# Altium project power_board.PrjPcb
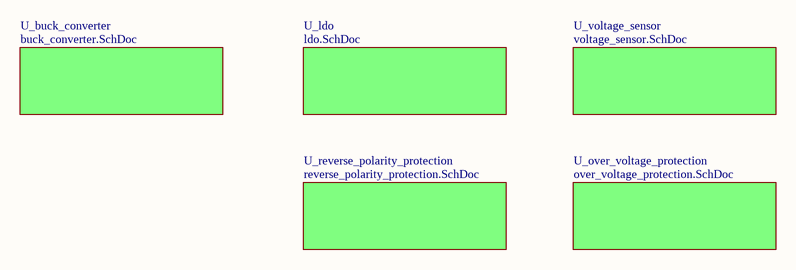
[diagram p0: top_level.SchDoc]
6 sheets, 18 parts. Net scope: hierarchical (ports join the sheet entries above them; power ports are global).
Board file: power_board_v0.PcbDoc
Sheets:
  top_level.SchDoc
    U_buck_converter = buck_converter.SchDoc
    U_voltage_sensor = voltage_sensor.SchDoc
    U_over_voltage_protection = over_voltage_protection.SchDoc
    U_reverse_polarity_protection = reverse_polarity_protection.SchDoc
  ldo_3v3.SchDoc

## Sheet top_level.SchDoc
size A3; SheetNumber: 1; SheetTotal: 6

### Sub-sheets
U_buck_converter = buck_converter.SchDoc: no entries
U_ldo = ldo.SchDoc (file not in this document): no entries
U_over_voltage_protection = over_voltage_protection.SchDoc: no entries
U_reverse_polarity_protection = reverse_polarity_protection.SchDoc: no entries
U_voltage_sensor = voltage_sensor.SchDoc: no entries

## Sheet buck_converter.SchDoc
size A3; SheetNumber: 2; SheetTotal: 2

## Sheet voltage_sensor.SchDoc
size A3; SheetNumber: 4; SheetTotal: 6

## Sheet over_voltage_protection.SchDoc
size A3; SheetNumber: 6; SheetTotal: 6

## Sheet reverse_polarity_protection.SchDoc
size A4; SheetNumber: 2; SheetTotal: 4
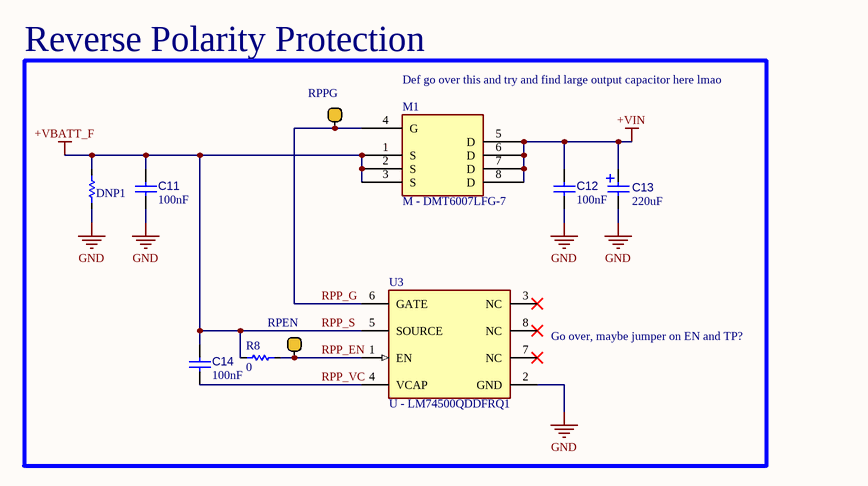
[diagram p1: reverse_polarity_protection.SchDoc]

### Parts
C11  value 100nF  [CAP_0603]  (hidden comment: C - CAP CER 100nF 100V 10% 0603)
C12  value 100nF  [CAP_0603]  (hidden comment: C - CAP CER 100nF 100V 10% 0603)
C13  value 220uF  [C - 860020574012]  (hidden comment: 860020574012)
C14  value 100nF  [CAP_0603]  (hidden comment: C - CAP CER 100nF 100V 10% 0603)
DNP1  DNP - DNP PAD 0603  [DNP 0603]  (value not drawn)
M1  M - DMT6007LFG-7  [M - DMT6007LFG-7]
R8  value 0  [RES 0603]  (hidden comment: R - RES 0R 0.1W N/A% 0603)
RPEN  TP - SMD Pad Testpoint-Symbol-1  [TP - SMD Pad Testpoint]  (value not drawn)
RPPG  TP - SMD Pad Testpoint-Symbol-1  [TP - SMD Pad Testpoint]  (value not drawn)
U3  U - LM74500QDDFRQ1  [U - LM74500QDDFRQ1]

### Nets
+VBATT_F: C11.2 C14.2 DNP1.2 M1.1(S) M1.2(S) M1.3(S) R8.1 U3.5(SOURCE)  [also labelled RPP_S]
+VIN: C12.2 C13.1(POS) M1.5(D) M1.6(D) M1.7(D) M1.8(D)
GND: C11.1 C12.1 C13.2(NEG) DNP1.1 U3.2(GND)
RPP_EN: R8.2 RPEN.1 U3.1(EN)
RPP_G: M1.4(G) RPPG.1 U3.6(GATE)
RPP_VC: C14.1 U3.4(VCAP)

Not connected (* = marked no-connect by the designer): U3 3(NC)* 7(NC)* 8(NC)*

### Notes on the sheet
- Reverse Polarity Protection
- (near M1) Def go over this and try and find large output capacitor here lmao
- (near U3) Go over, maybe jumper on EN and TP?

### Library data of the parts
C11 C12 C14 = C - CAP CER 100nF 100V 10% 0603: GRM188R72A104KA35D - 0.1 µF ±10% 100V Ceramic Capacitor X7R 0603 (1608 Metric); Parameter 2: *
C13 = C - CAP ELC 220uF 35V 20% CAN: 860020574012 - 220 µF 35 V Aluminum Electrolytic Capacitors Radial, Can 2000 Hrs @ 105°C; Parameter 2: *
M1 = M - DMT6007LFG-7: DMT6007LFG-7 - N-Channel 60 V 15A (Ta), 80A (Tc) 2.2W (Ta), 62.5W (Tc) Surface Mount POWERDI3333-8
R8 = R - RES 0R 0.1W N/A% 0603: ERJ-3GEY0R00V - 0 Ohms Jumper Chip Resistor 0603 (1608 Metric) Automotive AEC-Q200 Thick Film
RPEN RPPG = TP - SMD Pad Testpoint-Symbol-1: Testpoint used for debugging and testing. SMD Pad
U3 = U - LM74500QDDFRQ1: LM74500QDDFRQ1 - Battery Battery Protection IC TSOT-23-8

## Sheet ldo_3v3.SchDoc
size A; SheetNumber: 4; SheetTotal: 4
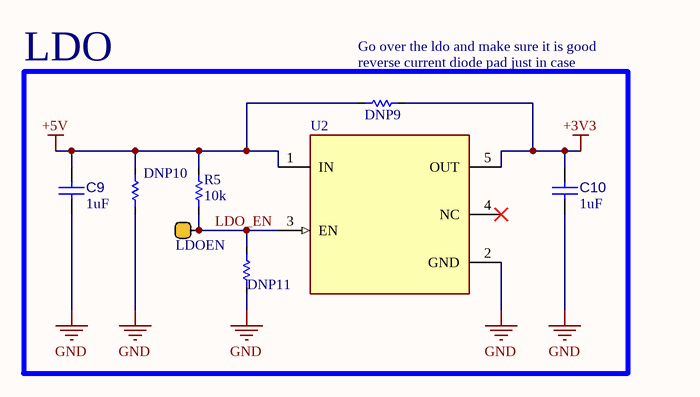
[diagram p2: ldo_3v3.SchDoc]

### Parts
C9  value 1uF  [CAP_0603]  (hidden comment: CAP CER 220nF 50V 10% 0603)
C10  value 1uF  [CAP_0603]  (hidden comment: CAP CER 220nF 50V 10% 0603)
DNP9  DNP - DNP PAD 0603  [DNP 0603]  (value not drawn)
DNP10  DNP - DNP PAD 0603  [DNP 0603]  (value not drawn)
DNP11  DNP - DNP PAD 0603  [DNP 0603]  (value not drawn)
LDOEN  TP - SMD Pad Testpoint-Symbol-1  [TP - SMD Pad Testpoint]  (value not drawn)
R5  value 10k  [RES 0603]  (hidden comment: R - RES 10kR 0.1W 1% 0603)
U2  TLV75733PDBVR  [U - TLV75733PDBVR]  (value not drawn)

### Nets
+3V3: C10.2 DNP9.2 U2.5(OUT)
+5V: C9.2 DNP9.1 DNP10.2 R5.2 U2.1(IN)
GND: C9.1 C10.1 DNP10.1 DNP11.1 U2.2(GND)
LDO_EN: DNP11.2 LDOEN.1 R5.1 U2.3(EN)

Not connected (* = marked no-connect by the designer): U2 4(NC)*

### Notes on the sheet
- (near DNP9) Go over the ldo and make sure it is good
- LDO
- (near DNP9) reverse current diode pad just in case

### Library data of the parts
C9 C10 = C - CAP CER 1uF 25V 10% 0603: GCJ188R71E105KA01D - 1 µF ±10% 25V Ceramic Capacitor X7R 0603 (1608 Metric); Parameter 2: *
LDOEN = TP - SMD Pad Testpoint-Symbol-1: as RPEN on sheet reverse_polarity_protection
R5 = R - RES 10kR 0.1W 1% 0603: ERA-3AEB103V - 10 kOhms ±0.1% 0.1W, 1/10W Chip Resistor 0603 (1608 Metric) Automotive AEC-Q200 Thin Film
U2 = U - TLV75733PDBVR: TLV75733PDBVR - 1-A, low-IQ high-accuracy low-dropout (LDO) voltage regulator with enable 5-SOT-23 -40 to 125; Manufacturer_Name: Texas Instruments; TYPE: TYPE; RefDes: RefDes; Copyright: Copyright (C) 2025 Ultra Librarian. All rights reserved.; Manufacturer_Part_Number: TLV75733PDBVR

## Nets that join several sheets
GND: reverse_polarity_protection (5 pins), ldo_3v3 (5 pins)